# EAGLE schematic LAB-PRIME (EAGLE 6.6.0)
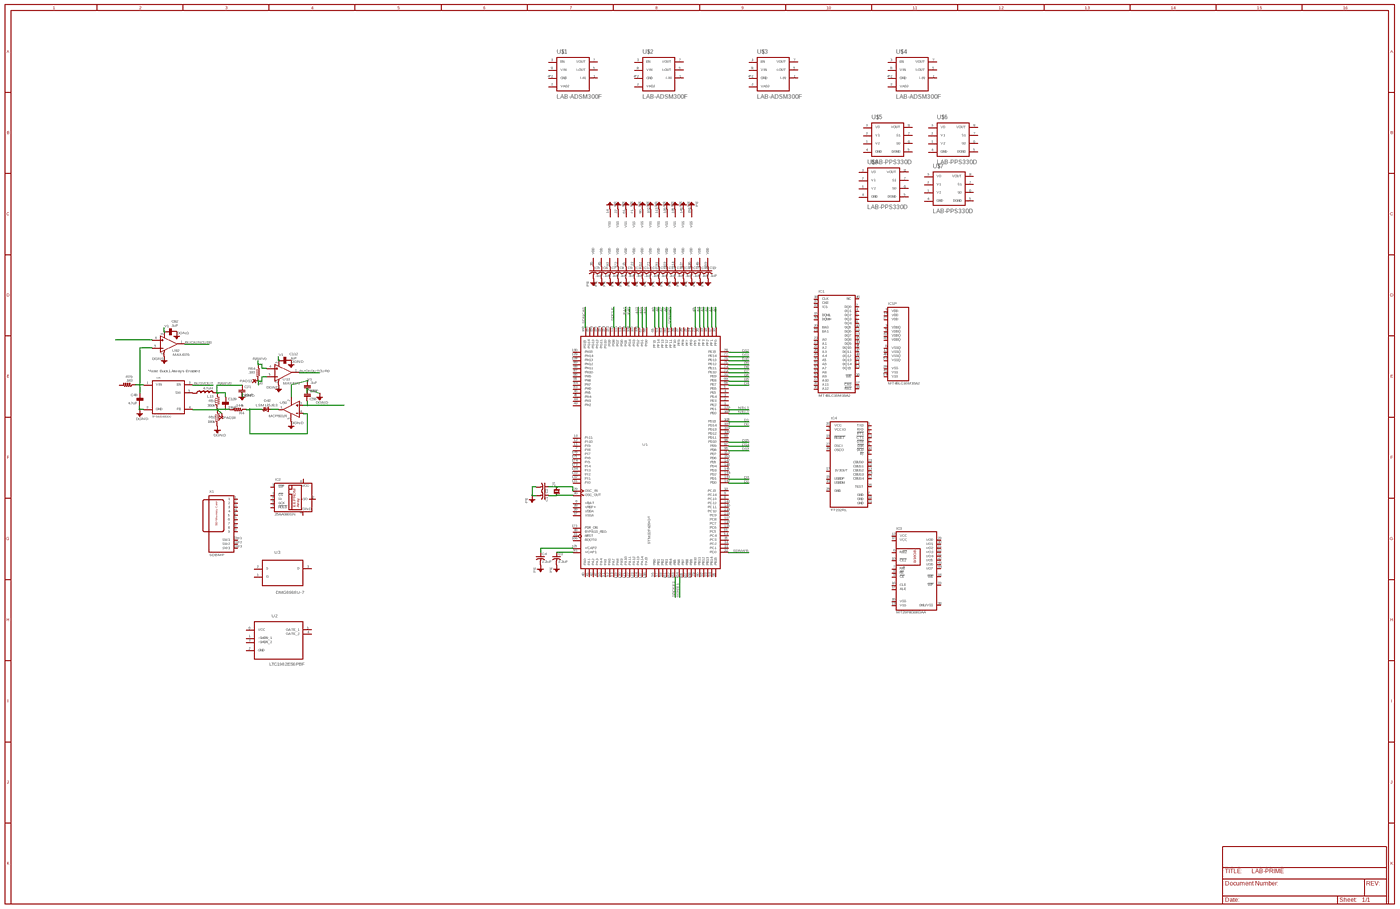
[diagram p0: schematic, sheet 1, overview]
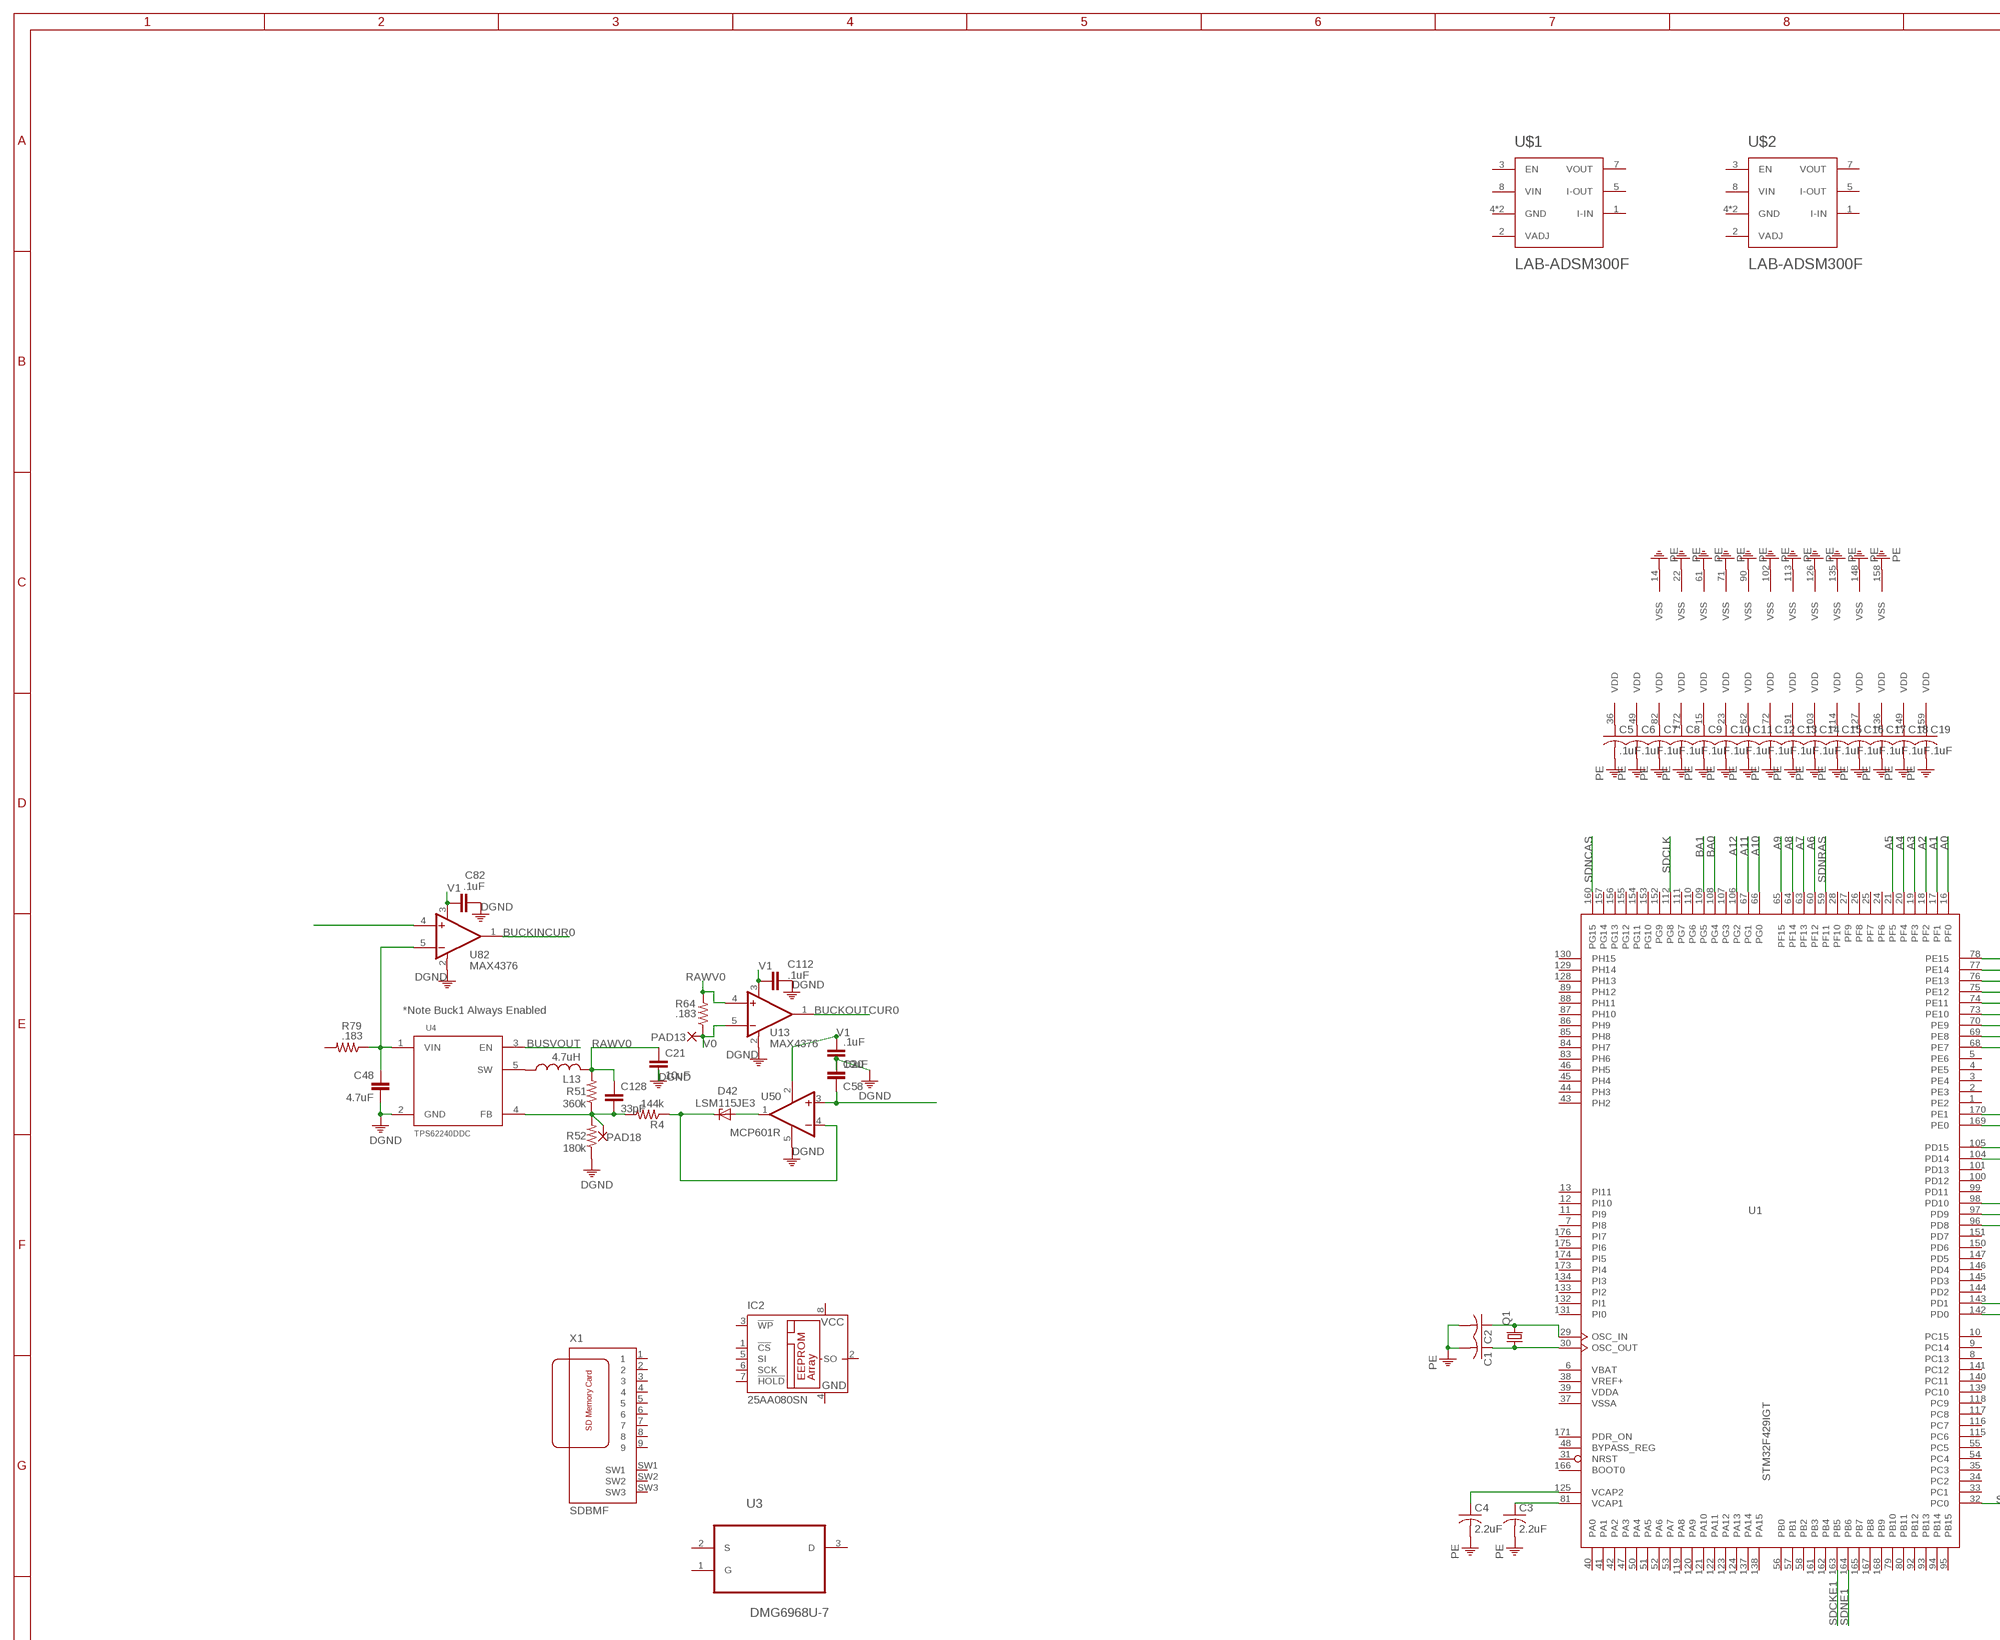
[diagram p1: schematic, sheet 1, part 1 of 4]
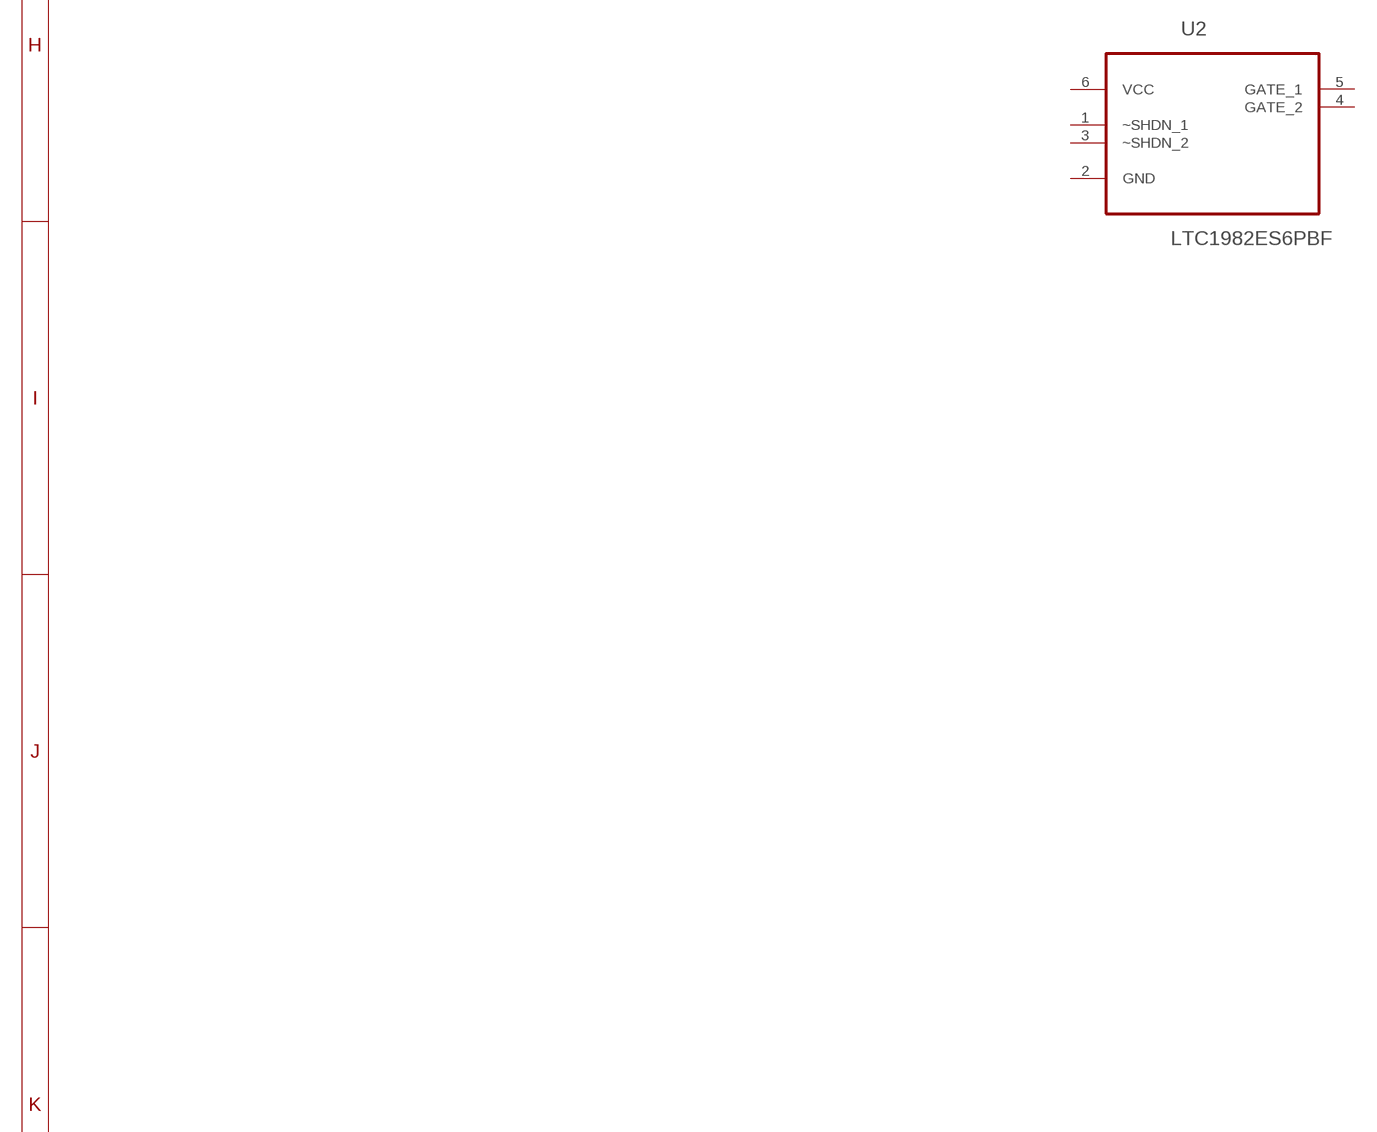
[diagram p2: schematic, sheet 1, part 2 of 4]
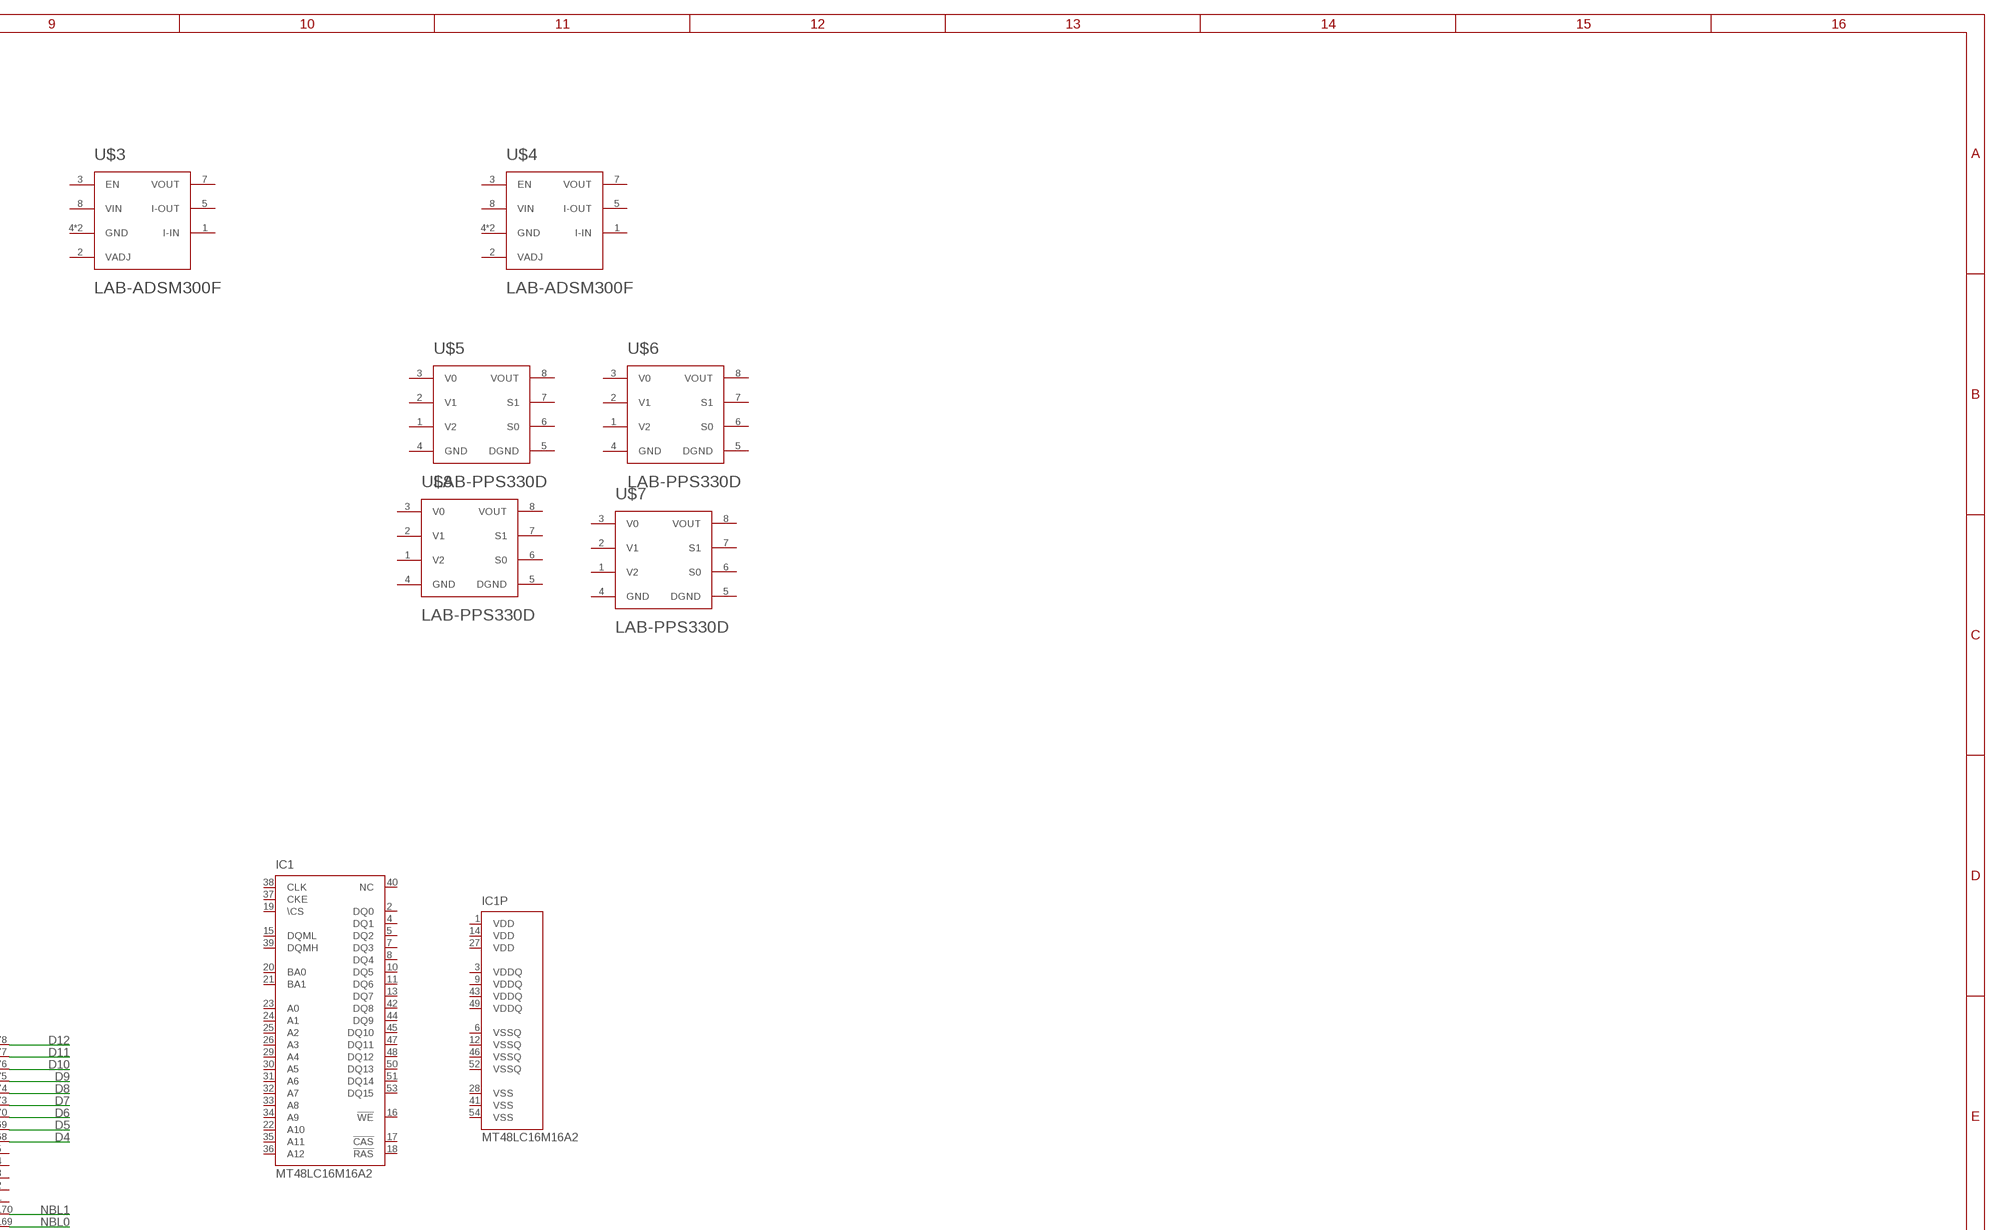
[diagram p3: schematic, sheet 1, part 3 of 4]
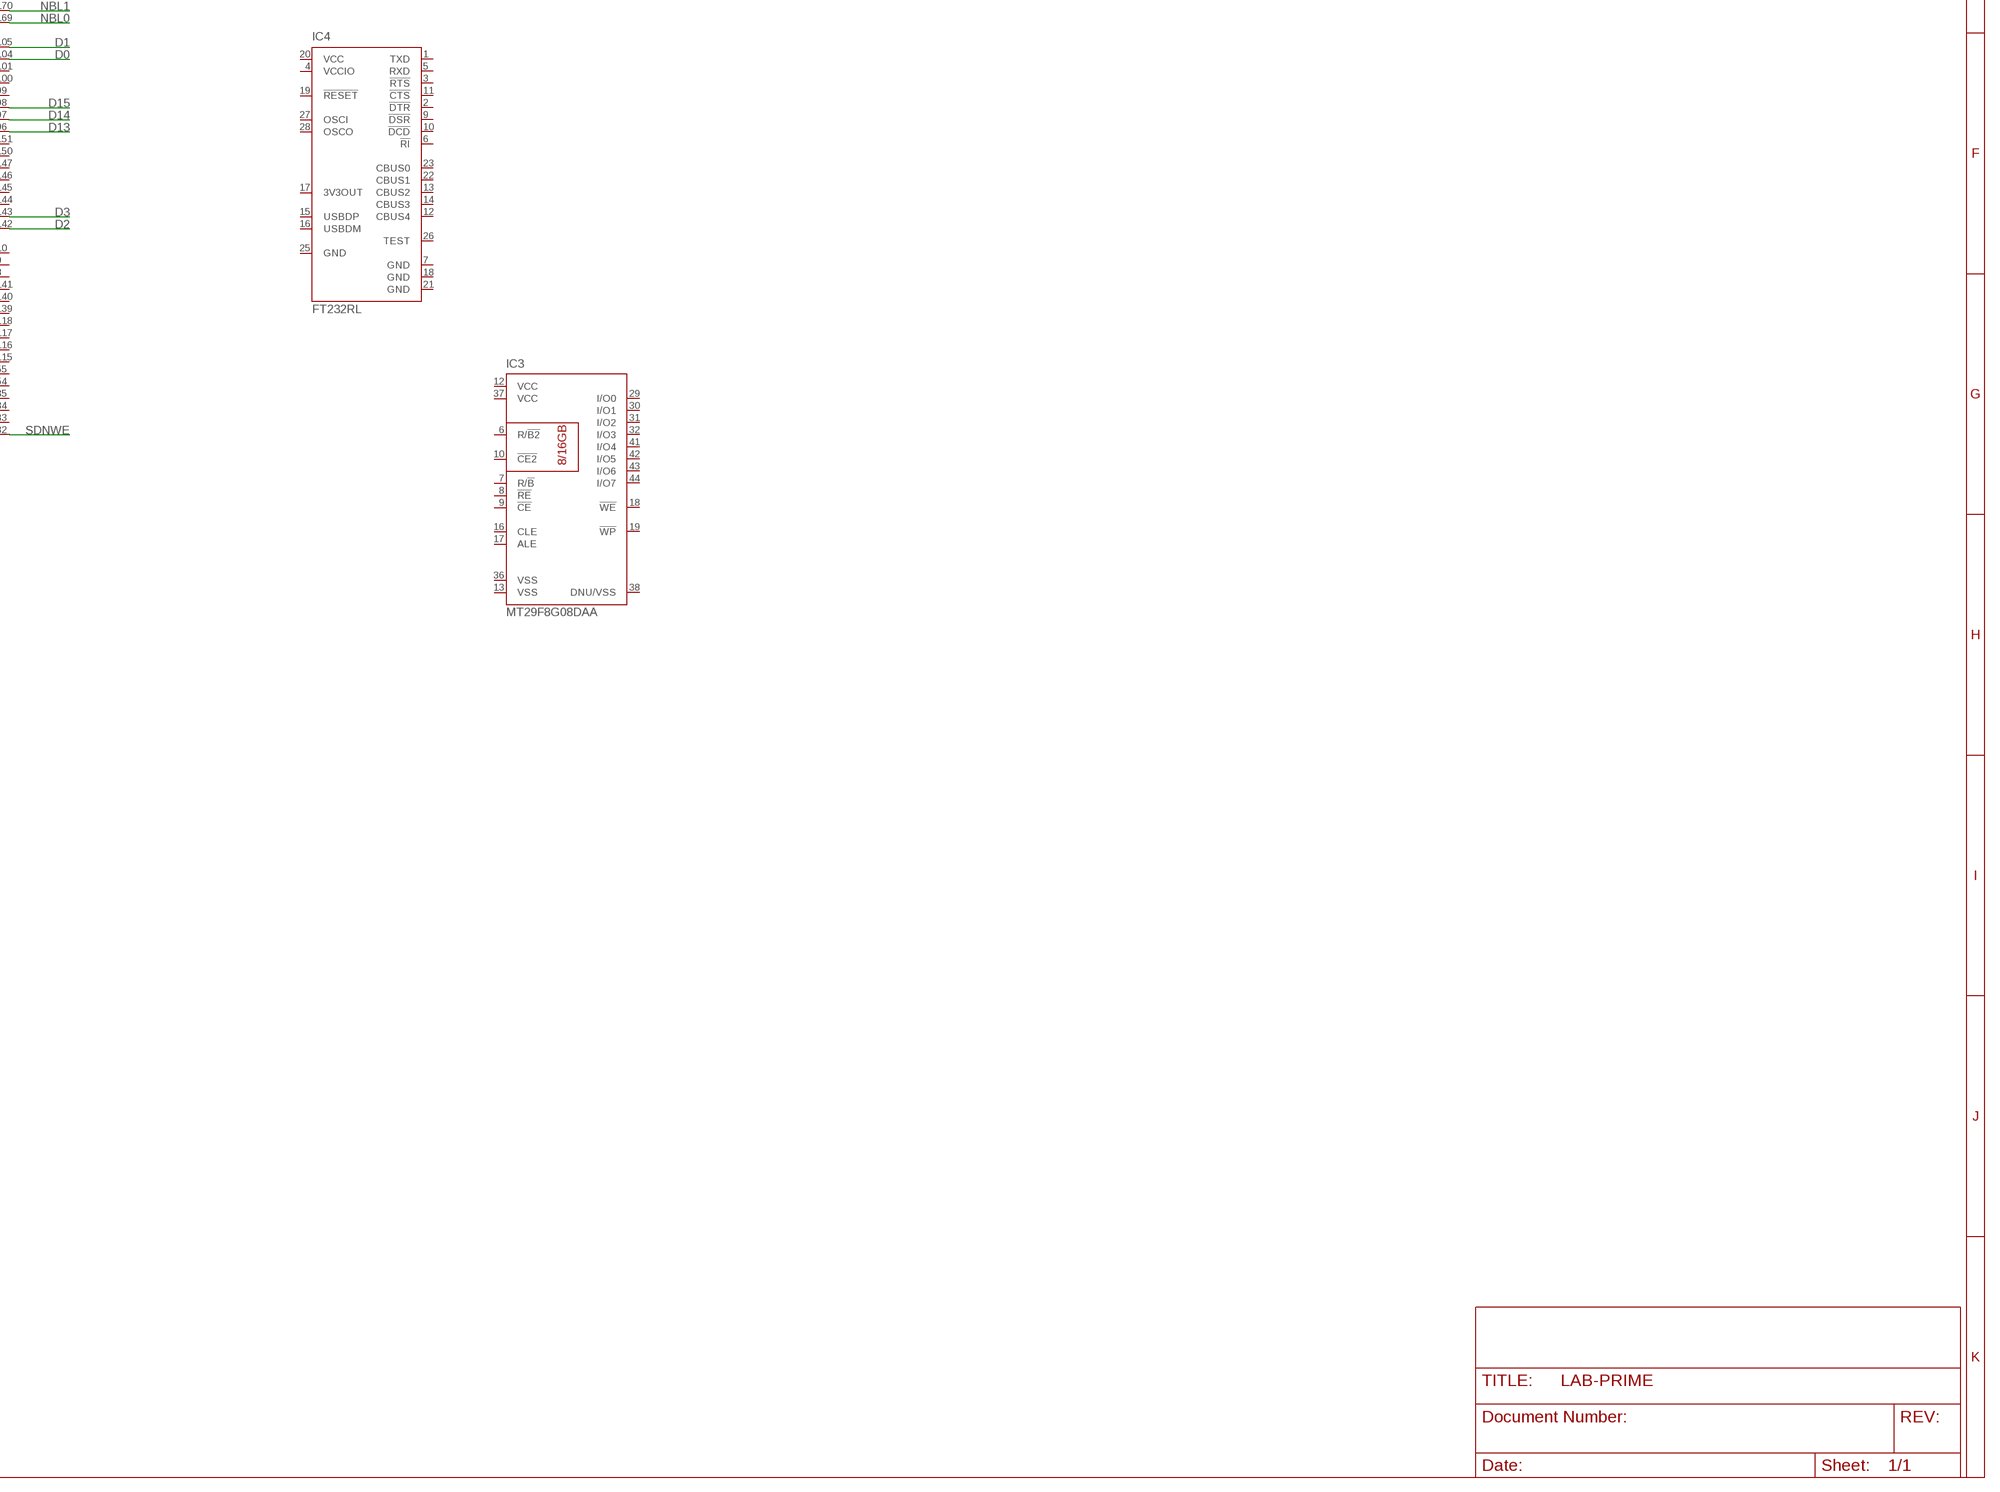
[diagram p4: schematic, sheet 1, part 4 of 4]

## Parts
C1  C-USC0402K  [C0402K]
C2  C-USC0402K  [C0402K]
C3  2.2uF  C-USC0402K  [C0402K]
C4  2.2uF  C-USC0402K  [C0402K]
C5  .1uF  C-USC0402K  [C0402K]
C6  .1uF  C-USC0402K  [C0402K]
C7  .1uF  C-USC0402K  [C0402K]
C8  .1uF  C-USC0402K  [C0402K]
C9  .1uF  C-USC0402K  [C0402K]
C10  .1uF  C-USC0402K  [C0402K]
C11  .1uF  C-USC0402K  [C0402K]
C12  .1uF  C-USC0402K  [C0402K]
C13  .1uF  C-USC0402K  [C0402K]
C14  .1uF  C-USC0402K  [C0402K]
C15  .1uF  C-USC0402K  [C0402K]
C16  .1uF  C-USC0402K  [C0402K]
C17  .1uF  C-USC0402K  [C0402K]
C18  .1uF  C-USC0402K  [C0402K]
C19  .1uF  C-USC0402K  [C0402K]
C20  .1uF  C-EUC0603  [C0603]
C21  10uF  C-EUC0603  [C0603]
C48  4.7uF  C-EUC0603  [C0603]
C58  10uF  C-EUC0603  [C0603]
C82  .1uF  C-EUC0603  [C0603]
C112  .1uF  C-EUC0603  [C0603]
C128  33pF  C-EUC0603  [C0603]
D42  LSM115JE3  [DO214BA]
IC1  MT48LC16M16A2  [TSOP54-400]
IC2  25AA080SN  [SO-08]
IC3  MT29F8G08DAA  [TSOP48]
IC4  FT232RL  [SSOP28]
L13  4.7uH  LQM2HP_G0  [L1008/2520METRIC]
PAD13  2,54/1,0  [2,54/1,0]
PAD18  2,54/1,0  [2,54/1,0]
Q1  CRYSTALCTS406  [CTS406]
R4  144k  R-US_R0603  [R0603]
R51  360k  R-US_R0603  [R0603]
R52  180k  R-US_R0603  [R0603]
R64  .183  R-US_R0603  [R0603]
R79  .183  R-US_R0603  [R0603]
U1  STM32F429IGT  [LQFP176]
U2  LTC1982ES6PBF  [SOT95P280X145-6N]
U3  DMG6968U-7  [SOT95P240X110-3N]
U4  TPS62240DDC  [SOT23-5]
U13  MAX4376  [SOT23-5]
U50  MCP601R  [SOT23-5]
U82  MAX4376  [SOT23-5]
U$1  LAB-ADSM300F  [LAB-ASDM300F]
U$2  LAB-ADSM300F  [LAB-ASDM300F]
U$3  LAB-ADSM300F  [LAB-ASDM300F]
U$4  LAB-ADSM300F  [LAB-ASDM300F]
U$5  LAB-PPS330D  [LAB-PPS330D]
U$6  LAB-PPS330D  [LAB-PPS330D]
U$7  LAB-PPS330D  [LAB-PPS330D]
U$8  LAB-PPS330D  [LAB-PPS330D]
X1  SDBMF  [SDBMF-009XXBXX2]

## Nets
A0: U1.16(PF0)
A1: U1.17(PF1)
A2: U1.18(PF2)
A3: U1.19(PF3)
A4: U1.20(PF4)
A5: U1.21(PF5)
A6: U1.60(PF12)
A7: U1.63(PF13)
A8: U1.64(PF14)
A9: U1.65(PF15)
A10: U1.66(PG0)
A11: U1.67(PG1)
A12: U1.106(PG2)
BA0: U1.108(PG4)
BA1: U1.109(PG5)
BUCKADJ0: C58.1 U50.3(+IN)
BUCKINCUR0: U82.1(OUT)
BUCKOUTCUR0: U13.1(OUT)
BUSVOUT: U4.3(EN) U82.4(+IN)
D0: U1.104(PD14)
D1: U1.105(PD15)
D2: U1.142(PD0)
D3: U1.143(PD1)
D4: U1.68(PE7)
D5: U1.69(PE8)
D6: U1.70(PE9)
D7: U1.73(PE10)
D8: U1.74(PE11)
D9: U1.75(PE12)
D10: U1.76(PE13)
D11: U1.77(PE14)
D12: U1.78(PE15)
D13: U1.96(PD8)
D14: U1.97(PD9)
D15: U1.98(PD10)
N$1: C1.1 Q1.1 U1.30(OSC_OUT)
N$2: C2.1 Q1.3 U1.29(OSC_IN)
N$3: C4.1 U1.125(VCAP2)
N$4: C3.1 U1.81(VCAP1)
N$5: C5.1 U1.36(VDD)
N$6: C6.1 U1.49(VDD)
N$7: C7.1 U1.82(VDD)
N$8: C8.1 U1.172(VDD)
N$9: C9.1 U1.15(VDD)
N$10: C10.1 U1.23(VDD)
N$11: C11.1 U1.62(VDD)
N$12: C12.1 U1.72(VDD)
N$13: C13.1 U1.91(VDD)
N$14: C14.1 U1.103(VDD)
N$15: C15.1 U1.114(VDD)
N$16: C16.1 U1.127(VDD)
N$17: C17.1 U1.136(VDD)
N$18: C18.1 U1.149(VDD)
N$19: C19.1 U1.159(VDD)
N$20: D42.C R4.1 U50.4(-IN)
N$21: L13.1 U4.5(SW)
N$27: C48.1 R79.1 U4.1(VIN) U82.5(-IN)
N$69: C128.2 PAD18.1(P) R4.2 R51.1 R52.2 U4.4(FB)
N$176: D42.A U50.1(OUT)
NBL0: U1.169(PE0)
NBL1: U1.170(PE1)
PE: C1.2 C2.2 C3.2 C4.2 C5.2 C6.2 C7.2 C8.2 C9.2 C10.2 C11.2 C12.2 C13.2 C14.2 C15.2 C16.2 C17.2 C18.2 C19.2 C20.1 C21.2 C48.2 C58.2 C82.1 C112.1 R52.1 U1.14(VSS) U1.22(VSS) U1.61(VSS) U1.71(VSS) U1.90(VSS) U1.102(VSS) U1.113(VSS) U1.126(VSS) U1.135(VSS) U1.148(VSS) U1.158(VSS) U4.2(GND) U13.2(V-) U50.5(V-) U82.2(V-) ; supply symbol labelled DGND
RAWV0: C21.1 C128.1 L13.2 R51.2 R64.2 U13.4(+IN)
SDCKE1: U1.163(PB5)
SDCLK: U1.112(PG8)
SDNCAS: U1.160(PG15)
SDNE1: U1.164(PB6)
SDNRAS: U1.59(PF11)
SDNWE: U1.32(PC0)
V0: PAD13.1(P) R64.1 U13.5(-IN)
V1: C20.2 C82.2 C112.2 U13.3(V+) U50.2(V+) U82.3(V+)
Unconnected: IC1.2(DQ0) IC1.4(DQ1) IC1.5(DQ2) IC1.7(DQ3) IC1.8(DQ4) IC1.10(DQ5) IC1.11(DQ6) IC1.13(DQ7) IC1.15(DQML) IC1.16(!WE) IC1.17(!CAS) IC1.18(!RAS) IC1.19(\CS) IC1.20(BA0) IC1.21(BA1) IC1.22(A10) IC1.23(A0) IC1.24(A1) IC1.25(A2) IC1.26(A3) IC1.29(A4) IC1.30(A5) IC1.31(A6) IC1.32(A7) IC1.33(A8) IC1.34(A9) IC1.35(A11) IC1.36(A12) IC1.37(CKE) IC1.38(CLK) IC1.39(DQMH) IC1.40(NC) IC1.42(DQ8) IC1.44(DQ9) IC1.45(DQ10) IC1.47(DQ11) IC1.48(DQ12) IC1.50(DQ13) IC1.51(DQ14) IC1.53(DQ15) IC2.1(!CS) IC2.2(SO) IC2.3(!WP) IC2.5(SI) IC2.6(SCK) IC2.7(!HOLD) IC3.6(R/!B2) IC3.7(R/!B) IC3.8(!RE) IC3.9(!CE) IC3.10(!CE2) IC3.16(CLE) IC3.17(ALE) IC3.18(!WE) IC3.19(!WP) IC3.25(DNU) IC3.26(DNU) IC3.29(I/O0) IC3.30(I/O1) IC3.31(I/O2) IC3.32(I/O3) IC3.38(DNU/VSS) IC3.41(I/O4) IC3.42(I/O5) IC3.43(I/O6) IC3.44(I/O7) IC3.48(DNU) IC4.1(TXD) IC4.2(!DTR) IC4.3(!RTS) IC4.5(RXD) IC4.6(!RI) IC4.9(!DSR) IC4.10(!DCD) IC4.11(!CTS) IC4.12(CBUS4) IC4.13(CBUS2) IC4.14(CBUS3) IC4.15(USBDP) IC4.16(USBDM) IC4.17(3V3OUT) IC4.19(!RESET) IC4.22(CBUS1) IC4.23(CBUS0) IC4.26(TEST) IC4.27(OSCI) IC4.28(OSCO) R79.2 U1.1(PE2) U1.2(PE3) U1.3(PE4) U1.4(PE5) U1.5(PE6) U1.7(PI8) U1.8(PC13) U1.9(PC14) U1.10(PC15) U1.11(PI9) U1.12(PI10) U1.13(PI11) U1.24(PF6) U1.25(PF7) U1.26(PF8) U1.27(PF9) U1.28(PF10) U1.31(NRST) U1.33(PC1) U1.34(PC2) U1.35(PC3) U1.40(PA0) U1.41(PA1) U1.42(PA2) U1.43(PH2) U1.44(PH3) U1.45(PH4) U1.46(PH5) U1.47(PA3) U1.48(BYPASS_REG) U1.50(PA4) U1.51(PA5) U1.52(PA6) U1.53(PA7) U1.54(PC4) U1.55(PC5) U1.56(PB0) U1.57(PB1) U1.58(PB2) U1.79(PB10) U1.80(PB11) U1.83(PH6) U1.84(PH7) U1.85(PH8) U1.86(PH9) U1.87(PH10) U1.88(PH11) U1.89(PH12) U1.92(PB12) U1.93(PB13) U1.94(PB14) U1.95(PB15) U1.99(PD11) U1.100(PD12) U1.101(PD13) U1.107(PG3) U1.110(PG6) U1.111(PG7) U1.115(PC6) U1.116(PC7) U1.117(PC8) U1.118(PC9) U1.119(PA8) U1.120(PA9) U1.121(PA10) U1.122(PA11) U1.123(PA12) U1.124(PA13) U1.128(PH13) U1.129(PH14) U1.130(PH15) U1.131(PI0) U1.132(PI1) U1.133(PI2) U1.134(PI3) U1.137(PA14) U1.138(PA15) U1.139(PC10) U1.140(PC11) U1.141(PC12) U1.144(PD2) U1.145(PD3) U1.146(PD4) U1.147(PD5) U1.150(PD6) U1.151(PD7) U1.152(PG9) U1.153(PG10) U1.154(PG11) U1.155(PG12) U1.156(PG13) U1.157(PG14) U1.161(PB3) U1.162(PB4) U1.165(PB7) U1.166(BOOT0) U1.167(PB8) U1.168(PB9) U1.171(PDR_ON) U1.173(PI4) U1.174(PI5) U1.175(PI6) U1.176(PI7) U2.1(~SHDN_1) U2.2(GND) U2.3(~SHDN_2) U2.4(GATE_2) U2.5(GATE_1) U3.2(S) U3.3(D) U$1.1(I-IN) U$1.2(VADJ) U$1.3(EN) U$1.5(I-OUT) U$1.7(VOUT) U$2.1(I-IN) U$2.2(VADJ) U$2.3(EN) U$2.5(I-OUT) U$2.7(VOUT) U$3.1(I-IN) U$3.2(VADJ) U$3.3(EN) U$3.5(I-OUT) U$3.7(VOUT) U$4.1(I-IN) U$4.2(VADJ) U$4.3(EN) U$4.5(I-OUT) U$4.7(VOUT) U$5.1(V2) U$5.2(V1) U$5.5(DGND) U$5.6(S0) U$5.7(S1) U$5.8(VOUT) U$6.1(V2) U$6.2(V1) U$6.5(DGND) U$6.6(S0) U$6.7(S1) U$6.8(VOUT) U$7.1(V2) U$7.2(V1) U$7.5(DGND) U$7.6(S0) U$7.7(S1) U$7.8(VOUT) U$8.1(V2) U$8.2(V1) U$8.5(DGND) U$8.6(S0) U$8.7(S1) U$8.8(VOUT) X1.1 X1.2 X1.3 X1.4 X1.5 X1.6 X1.7 X1.8 X1.9 X1.SW1 X1.SW2 X1.SW3

## Notes on the sheet
- *Note Buck1 Always Enabled

## Power pins joined to a net without a drawn wire
G: U3.1(G)
GND: IC2.4(GND) IC4.7(GND) IC4.18(GND) IC4.21(GND) IC4.25(GND) U$1.4(GND) U$1.6(GND) U$2.4(GND) U$2.6(GND) U$3.4(GND) U$3.6(GND) U$4.4(GND) U$4.6(GND) U$5.4(GND) U$6.4(GND) U$7.4(GND) U$8.4(GND)
V0: U$5.3(V0) U$6.3(V0) U$7.3(V0) U$8.3(V0)
VBAT: U1.6(VBAT)
VCC: IC2.8(VCC) IC3.12(VCC) IC3.37(VCC) IC4.20(VCC) U2.6(VCC)
VCCIO: IC4.4(VCCIO)
VDD: IC1.1(VDD) IC1.14(VDD) IC1.27(VDD)
VDDA: U1.39(VDDA)
VDDQ: IC1.3(VDDQ) IC1.9(VDDQ) IC1.43(VDDQ) IC1.49(VDDQ)
VIN: U$1.8(VIN) U$2.8(VIN) U$3.8(VIN) U$4.8(VIN)
VREF+: U1.38(VREF+)
VSS: IC1.28(VSS) IC1.41(VSS) IC1.54(VSS) IC3.13(VSS) IC3.36(VSS)
VSSA: U1.37(VSSA)
VSSQ: IC1.6(VSSQ) IC1.12(VSSQ) IC1.46(VSSQ) IC1.52(VSSQ)

## Library data of the parts
C1-C19 = rcl:C-US: CAPACITOR, American symbol
C20 C21 C48 C58 C82 C112 C128 = rcl:C-EU: CAPACITOR, European symbol
D42 = IKE:LSM115JE3: Z DIODE
IC1 = memory-micron:MT48LC16M16A2: 256Mb: x16 SDRAM MT48LC16M16A2 - 4 Meg x 16 x 4 banks Source: http://download.micron.com/pdf/datasheets/dram/sdram/256MSDRAM.pdf; OC_FARNELL: unknown; OC_NEWARK: unknown
IC2 = microchip:25*: Serial EEPROM 4K/ 8K , SPI bus; MF: MICROCHIP; MPN: 25AA080/SN; OC_FARNELL: 1816072; OC_NEWARK: 92C7351
IC3 = memory-micron:MT29F8G08DAA: 4Gb, 8Gb, and 16Gb x8 NAND Flash Memory Source: http://download.micron.com/pdf/datasheets/flash/nand/4gb_nand_m40a.pdf; OC_FARNELL: unknown; OC_NEWARK: unknown
IC4 = ftdichip:FT232R: Source: http://www.ftdichip.com/Documents/DataSheets/DS_FT232R_v104.pdf; MPN: FT232RL; OC_FARNELL: 1146032; OC_NEWARK: 91K9918
L13 = IKE:LQM2HP_G0
PAD13 PAD18 = wirepad:2,54/1,0: THROUGH-HOLE PAD
Q1 = crystal:CRYSTAL: CRYSTAL; OC_FARNELL: unknown; OC_NEWARK: unknown
R4 R51 R52 R64 R79 = rcl:R-US_: RESISTOR, American symbol
U1 = micro-stm_v2:STM32F429I*T: ARM 32-bit Cortex™-M3 CPU 180 MHz maximum frequency 1024 to 2048 Kbytes of Flash memory 256 kbytes of SRAM 140 GPIOs 1.8 to 3.6 V application supply
U2 = LTC_By_element14_Batch_1:LTC1982ES6PBF: Single and Dual Micropower High Side Switch Controllers in SOT-23; MPN: LTC1982ES6#PBF; OC_FARNELL: -; OC_NEWARK: 25R3032; PACKAGE: TSOT-23-6; SUPPLIER: Linear Technology
U3 = Diodes_Inc_By_element14_Batch_1:DMG6968U-7: N-CHANNEL ENHANCEMENT MODE MOSFET; MPN: DMG6968U-7; OC_FARNELL: 1843757; OC_NEWARK: 12T2027; PACKAGE: SOT-23-3; SUPPLIER: Diodes Inc
U4 = IKE:TPS62240DDC
U13 U82 = IKE:MAX4376
U50 = linear:MCP601: Single Op Amp 2.7V to 6.0V Single Supply CMOS Source: http://ww1.microchip.com/downloads/en/DeviceDoc/21314g.pdf
U$1-U$4 = LAB304:LAB-ADSM300F
U$5-U$8 = LAB304:LAB-PPS330D
X1 = farnell:SDBMF: SD MEMORY CARD PUSH-PUSH WITH CONNECTOR TYPE B (BIG SWUÌTCH #3) KINGFONT PRECISION INDUSTIAL CO., LTD Source: http://www.farnell.com/datasheets/74273.pdf Best.-Nr.: 9186174 Hersteller: MULTICOMP Herstellerbez.: SDBMF-00915B0T2